# EAGLE design 7ch_op_amp_board_v31 (EAGLE 7.2.0)
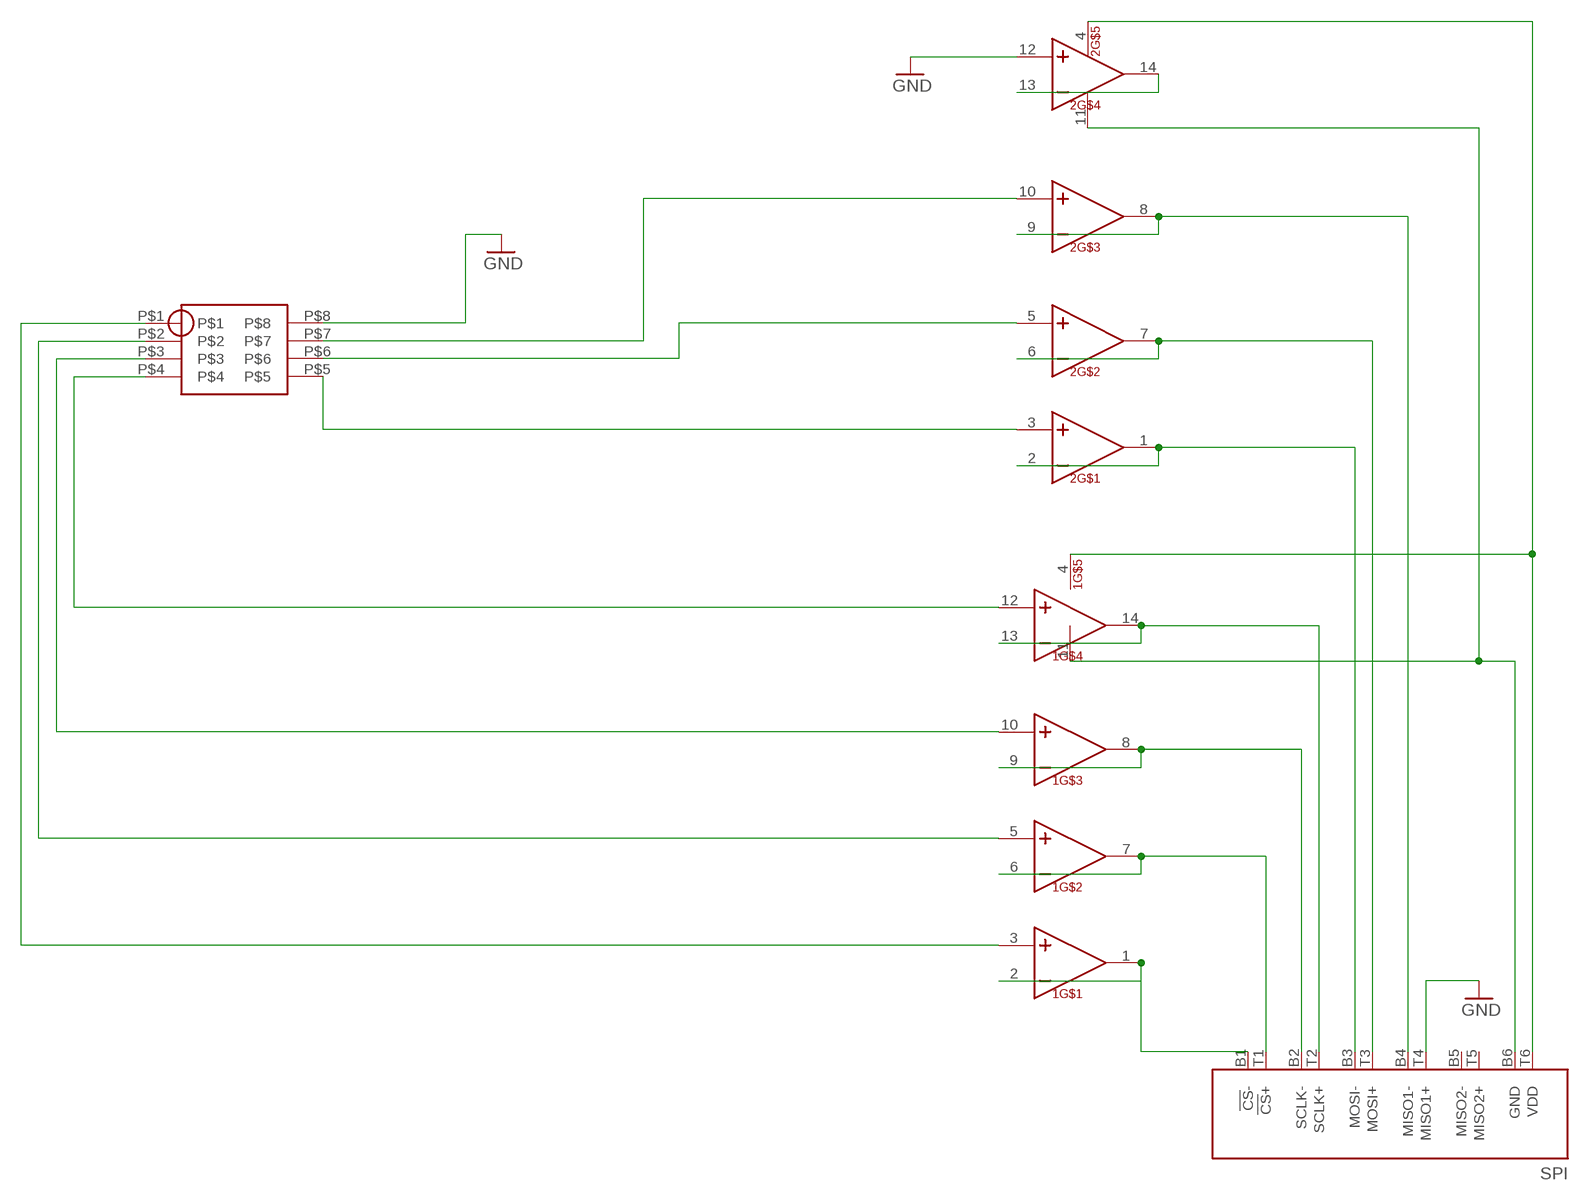
[diagram p0: schematic, sheet 1]

## Parts
1  TL074-TSSOP  [TSSOP14]
2  TL074-TSSOP  [TSSOP14]
B  853-PPP-8-SOLDERTAIL  [853-PPP-8]
SPI  RHD2000-CABLE-AMP-SIDE  [OMNETICS_PZN-12-AA]

## Nets
GND: 2.12(IN+) B.P$8 SPI.T4(MISO1+)
N$1: 1.1(OUT) 1.2(IN-) SPI.B1(!CS!-)
N$2: 1.6(IN-) 1.7(OUT) SPI.T1(!CS!+)
N$3: 2.1(OUT) 2.2(IN-) SPI.B3(MOSI-)
N$4: 2.6(IN-) 2.7(OUT) SPI.T3(MOSI+)
N$5: 2.8(OUT) 2.9(IN-) SPI.B4(MISO1-)
N$6: 2.13(IN-) 2.14(OUT)
N$7: 1.13(IN-) 1.14(OUT) SPI.T2(SCLK+)
N$8: 1.12(IN+) B.P$4
N$9: 1.8(OUT) 1.9(IN-) SPI.B2(SCLK-)
N$11: 1.3(IN+) B.P$1
N$12: 1.5(IN+) B.P$2
N$13: 1.10(IN+) B.P$3
N$15: 2.3(IN+) B.P$5
N$16: 2.5(IN+) B.P$6
N$17: 2.10(IN+) B.P$7
V+: 1.4(VCC+) 2.4(VCC+) SPI.T6(VDD)
V-: 1.11(VCC-) 2.11(VCC-) SPI.B6(GND)
Unconnected: SPI.B5(MISO2-) SPI.T5(MISO2+)

## Library data of the parts
1 2 = kjbrown:TL074-TSSOP
B = kjbrown:853-PPP-8-SOLDERTAIL
SPI = RHD2000:RHD2000-CABLE-AMP-SIDE

## Board
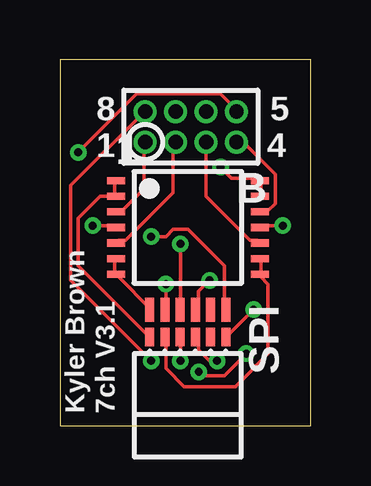
[diagram p1: board, top side]
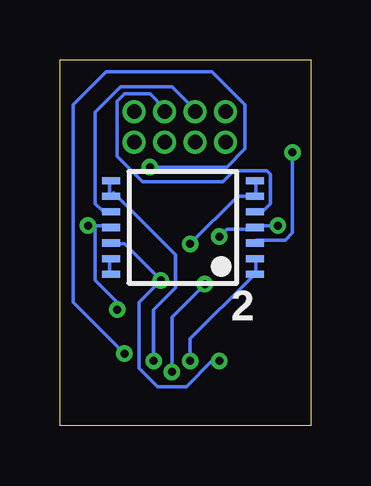
[diagram p2: board, bottom side, seen from below]

Size 10.46 x 15.23 mm. Coordinates in mm from the lower left corner, seen from the top.
Outline: 0,0 10.46,0 10.46,15.23 0,15.23 0,0
Copper layers (1*16): Top 0.0356mm / dielectric 1.5011mm / Bottom 0.0356mm
Design rules "LaenPCBOrder": minimum track width 6mil, minimum drill 13mil, track to track 6mil, track to pad 6mil, pad to pad 6mil, via to via 6mil, smd to smd 6mil, copper to edge 15mil, drill to drill 6mil, minimum pad ring 7mil, minimum via ring 7mil, stop-mask expansion 3mil, vias tented up to drill 0mil, thermal gap 10mil

### Footprints (pad centres in the part's own frame; a part is rotated, then mirrored left to right if it is on the bottom)
TSSOP14 = smd 0.3 x 0.75: 1 -1.95,-3; 2 -1.3,-3; 3 -0.65,-3; 4 0,-3; 5 0.65,-3; 6 1.3,-3; 7 1.95,-3; 8 1.95,3; 9 1.3,3; 10 0.65,3; 11 0,3; 12 -0.65,3; 13 -1.3,3; 14 -1.95,3
853-PPP-8 = drill 0.6 pad 0.813: P$1 -1.27,2.54; P$2 -1.27,1.27; P$3 -1.27,0; P$4 -1.27,-1.27; P$5 0,-1.27; P$6 0,0; P$7 0,1.27; P$8 0,2.54
OMNETICS_PZN-12-AA = smd 0.381 x 0.762: B1 1.587,-1.016; B2 0.953,-1.016; B3 0.318,-1.016; B4 -0.318,-1.016; B5 -0.953,-1.016; B6 -1.587,-1.016 | smd 0.381 x 1.016: T1 1.587,-2.159; T2 0.953,-2.159; T3 0.318,-2.159; T4 -0.318,-2.159; T5 -0.953,-2.159; T6 -1.587,-2.159

### Placement (x,y rotation side)
1  5.33,8.25 270 top
2  5.33,8.25 90 bottom
B  6.1,13.08 90 top
SPI  5.33,2.67 180 top

### Tracks (layer width: path | path; a pad name or v marks a point on that pad's centre or on a via)
GND  (via drill 0.33)
  Top 0.152: v6.25,6.04 5.79,5.59 5.79,4.83 SPI.T4 | v3.81,2.69 0.46,6.04 0.46,10.01 3.5,13.06 B.P$8
  Bottom 0.152: 2.12 8.23,7.57 7.77,7.57 v6.25,6.04 7.16,5.13 7.16,2.39 6.4,1.63 5.18,1.63 4.12,2.69 v3.81,2.69
N$1
  Top 0.152: 1.1 2.29,10.16 2.29,9.7 1.2 2.29,9.55 1.68,9.55 0.76,8.64 0.76,6.65 3.66,3.76 SPI.B1
N$2
  Top 0.152: 1.6 2.29,6.81 2.29,6.35 1.7 2.44,6.2 3.81,4.83 SPI.T1
N$3  (via drill 0.33)
  Top 0.152: v5.03,2.69 5.03,3.61 SPI.B3
  Bottom 0.152: 2.2 2.29,6.81 2.29,6.35 2.1 2.44,6.2 5.03,3.61 v5.03,2.69
N$4  (via drill 0.33)
  Top 0.152: v5.03,7.57 SPI.T3
  Bottom 0.152: 2.7 2.29,10.16 2.29,9.7 2.6 2.44,9.55 3.05,9.55 v5.03,7.57
N$5  (via drill 0.33)
  Top 0.152: v6.55,2.69 6.25,2.69 5.79,3.15 5.79,3.61 SPI.B4
  Bottom 0.152: 2.8 8.38,10.16 8.38,9.7 2.9 8.23,9.7 5.64,7.11 5.64,5.74 6.55,4.83 v6.55,2.69
N$6
  Bottom 0.152: 2.14 8.38,6.35 8.38,6.81 2.13
N$7  (via drill 0.33)
  Top 0.152: 1.13 8.38,9.7 8.38,10.16 1.14 8.23,10.31 7.16,10.31 v6.71,10.77 | v7.77,3 6.86,2.08 5.94,2.08 v5.79,2.24 | v4.42,5.89 4.42,4.83 SPI.T2
  Bottom 0.152: v6.71,10.77 3.5,10.77 2.74,11.53 2.74,13.36 4.12,14.73 8.53,14.73 9.91,13.36 9.91,5.13 v7.77,3 | v5.79,2.24 5.79,4.52 v4.42,5.89
N$8
  Top 0.152: 1.12 8.38,8.94 8.69,8.94 8.99,9.25 8.99,10.46 7.77,11.68 7.47,11.68 B.P$4
N$9
  Top 0.152: 1.9 8.38,6.81 8.38,6.35 1.8 8.38,6.2 8.69,5.89 8.69,3 7.32,1.63 5.18,1.63 4.42,2.39 4.42,3.61 SPI.B2
N$11
  Top 0.152: 1.3 2.44,8.94 2.59,8.94 3.5,9.86 3.5,11.68 B.P$1
N$12
  Top 0.152: 1.5 2.44,7.72 2.74,7.72 4.72,9.7 4.72,11.68 B.P$2
N$13
  Top 0.152: B.P$3 6.1,9.55 7.92,7.72 8.23,7.72 1.10
N$15  (via drill 0.33)
  Top 0.152: v0.76,11.38 3.2,13.82 6.71,13.82 7.32,13.21 B.P$5
  Bottom 0.152: v0.76,11.38 0.76,8.03 1.07,7.72 2.29,7.72 2.3
N$16
  Bottom 0.152: 2.5 2.29,8.94 1.98,8.94 1.68,9.25 1.68,10.46 1.83,10.62 3.2,10.62 3.66,10.16 7.01,10.16 8.08,11.23 8.08,13.51 7.77,13.82 6.71,13.82 6.1,13.21 B.P$6
N$17
  Bottom 0.152: 2.10 8.38,8.94 8.69,8.94 8.99,9.25 8.99,13.06 7.92,14.12 5.79,14.12 4.88,13.21 B.P$7
V+  (via drill 0.33)
  Top 0.152: v1.37,8.33 2.29,8.33 1.4 | v3.81,7.87 4.42,7.87 4.72,8.18 5.33,8.18 6.86,6.65 6.86,4.83 SPI.T6
  Bottom 0.152: v1.37,8.33 2.29,8.33 1.4 2.44,8.18 3.5,8.18 v3.81,7.87
V-  (via drill 0.33)
  Top 0.152: v9.3,8.33 8.38,8.33 1.11 | v8.08,4.83 7.01,3.76 SPI.B6
  Bottom 0.152: 8.99,8.33 8.38,8.33 1.11 | v8.08,4.83 8.08,5.13 8.99,6.04 8.99,8.33 | 8.99,8.33 v9.3,8.33

### Text on the board
_tsilk: 8 | 5 | 1 | 1 | 4 | B | SPI | Kyler Brown | 7ch V3.1
_bsilk: 2